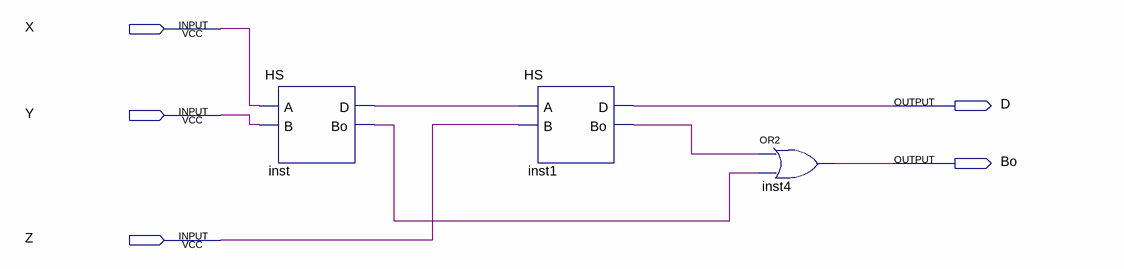
[diagram p0: schematic sheet]
// Quartus schematic fs.bdf as structural Verilog: 3 symbols, 5 pins
module fs (
  input  X,
  input  Y,
  input  Z,
  output D,
  output Bo
);

  wire inst1_bo, inst_bo, inst_d;

  HS inst (.A(X), .B(Y), .D(inst_d), .Bo(inst_bo));
  HS inst1 (.A(inst_d), .B(Z), .D(D), .Bo(inst1_bo));
  or inst4 (Bo, inst1_bo, inst_bo);
endmodule
